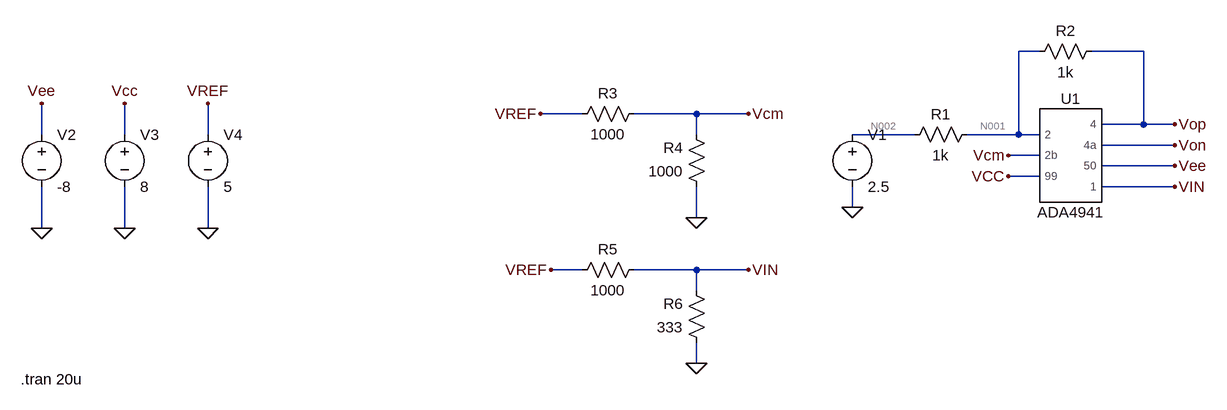
[diagram p0: schematic АЦПДрайвер.asc]
АЦПДрайвер.asc, the LTspice schematic file:
Version 4.1
SHEET 1 880 680
WIRE 224 -48 192 -48
WIRE 384 -48 304 -48
WIRE -480 48 -544 48
WIRE -304 48 -400 48
WIRE -224 48 -304 48
WIRE 384 64 384 -48
WIRE 384 64 320 64
WIRE 432 64 384 64
WIRE -1312 80 -1312 32
WIRE -1184 80 -1184 32
WIRE -1056 80 -1056 32
WIRE -304 80 -304 48
WIRE 32 80 -64 80
WIRE 192 80 192 -48
WIRE 192 80 112 80
WIRE 224 80 192 80
WIRE 432 96 320 96
WIRE 224 112 176 112
WIRE 432 128 320 128
WIRE 224 144 176 144
WIRE 432 160 320 160
WIRE -64 192 -64 160
WIRE -304 208 -304 160
WIRE -1312 224 -1312 160
WIRE -1184 224 -1184 160
WIRE -1056 224 -1056 160
WIRE -480 288 -528 288
WIRE -304 288 -400 288
WIRE -224 288 -304 288
WIRE -304 320 -304 288
WIRE -304 432 -304 400
FLAG 432 96 Von
FLAG 432 64 Vop
FLAG 432 128 Vee
FLAG 432 160 VIN
FLAG 176 112 Vcm
FLAG 176 144 VCC
FLAG -64 192 0
FLAG -304 208 0
FLAG -224 48 Vcm
FLAG -304 432 0
FLAG -224 288 VIN
FLAG -528 288 VREF
FLAG -544 48 VREF
FLAG -1056 224 0
FLAG -1184 224 0
FLAG -1312 224 0
FLAG -1312 32 Vee
FLAG -1184 32 Vcc
FLAG -1056 32 VREF
SYMBOL ADA4941 272 112 R0
SYMATTR InstName U1
SYMBOL res 128 64 R90
WINDOW 0 0 56 VBottom 2
WINDOW 3 32 56 VTop 2
SYMATTR InstName R1
SYMATTR Value 1k
SYMBOL res 320 -64 R90
WINDOW 0 0 56 VBottom 2
WINDOW 3 32 56 VTop 2
SYMATTR InstName R2
SYMATTR Value 1k
SYMBOL voltage -64 64 R0
WINDOW 123 0 0 Left 0
WINDOW 39 0 0 Left 0
SYMATTR InstName V1
SYMATTR Value 2.5
SYMBOL res -384 32 R90
WINDOW 0 0 56 VBottom 2
WINDOW 3 32 56 VTop 2
SYMATTR InstName R3
SYMATTR Value 1000
SYMBOL res -288 176 R180
WINDOW 0 36 76 Left 2
WINDOW 3 36 40 Left 2
SYMATTR InstName R4
SYMATTR Value 1000
SYMBOL res -384 272 R90
WINDOW 0 0 56 VBottom 2
WINDOW 3 32 56 VTop 2
SYMATTR InstName R5
SYMATTR Value 1000
SYMBOL res -288 416 R180
WINDOW 0 36 76 Left 2
WINDOW 3 36 40 Left 2
SYMATTR InstName R6
SYMATTR Value 333
SYMBOL voltage -1312 64 R0
WINDOW 123 0 0 Left 0
WINDOW 39 0 0 Left 0
SYMATTR InstName V2
SYMATTR Value -8
SYMBOL voltage -1184 64 R0
WINDOW 123 0 0 Left 0
WINDOW 39 0 0 Left 0
SYMATTR InstName V3
SYMATTR Value 8
SYMBOL voltage -1056 64 R0
WINDOW 123 0 0 Left 0
WINDOW 39 0 0 Left 0
SYMATTR InstName V4
SYMATTR Value 5
TEXT -1344 456 Left 2 !.tran 20u

The netlist it stands for:
* АЦПДрайвер.asc
X§U1 N001 Vcm VCC Vop Von Vee VIN ADA4941  ; pins 2 2b 99 4 4a 50 1
R1 N001 N002 1k
R2 Vop N001 1k
V1 N002 0 2.5
R3 Vcm VREF 1000
R4 0 Vcm 1000
R5 VIN VREF 1000
R6 0 VIN 333
V2 Vee 0 -8
V3 VCC 0 8
V4 VREF 0 5
.tran 20u
.lib ada4941.cir
.backanno
.end

* Results of the author's LTspice run, read from the files saved beside the schematic
* Operating Point, zero values left out:
*   V(vcm) = 2.498 V
*   V(vop) = -528.7 µV
*   V(von) = 4.997 V
*   V(vin) = 1.248 V
*   V(n001) = 1.248 V
*   V(vcc) = 8 V
*   V(vee) = -8 V
*   V(n002) = 2.5 V
*   V(vref) = 5 V
*   I(R3) = -2.502 mA
*   I(R5) = -3.752 mA
*   I(R1) = -1.252 mA
*   I(V3) = 45.84 µA
*   I(R2) = -1.249 mA
*   I(V1) = -1.252 mA
*   I(R4) = -2.498 mA
*   I(R6) = -3.749 mA
*   I(V2) = 2.446 mA
*   I(V4) = -6.253 mA
*   Ix(u1:2) = 2.95 µA
*   Ix(u1:2b) = 3.05 µA
*   Ix(u1:99) = -45.84 µA
*   Ix(u1:4) = 1.249 mA
*   Ix(u1:50) = -2.446 mA
*   Ix(u1:1) = 3.05 µA